# Altium schematic sheet Ethernet.SchDoc
size A; SheetNumber: 1; SheetTotal: 1
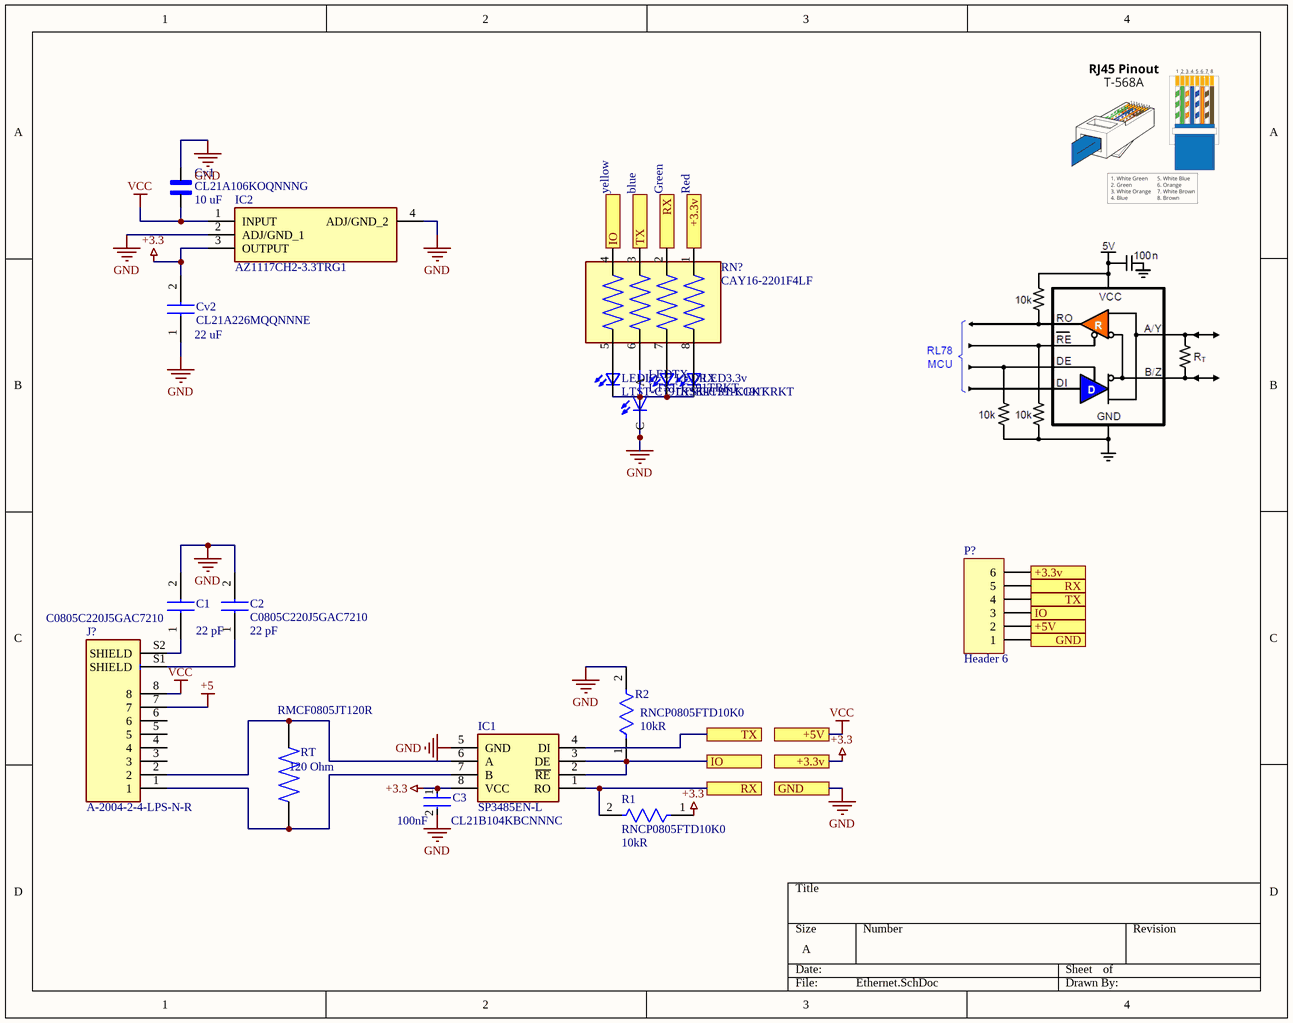
[diagram p0: Ethernet.SchDoc]

## Parts
C1  C0805C220J5GAC7210  Capacitance: 22 pF  [C0805]
C2  C0805C220J5GAC7210  Capacitance: 22 pF  [C0805]
C3  CL21B104KBCNNNC  Capacitance: 100nF  [FP-CL21-IPC_C]
Cv1  CL21A106KOQNNNG  value 10 uF  [CAPC2012X140N]
Cv2  CL21A226MQQNNNE  value 22 uF  [CAPC2012X140N]
IC1  SP3485EN-L  [SOIC127P600X175-8N]
IC2  AZ1117CH2-3.3TRG1  [SOT230P700X180-4N]
J?  A-2004-2-4-LPS-N-R  [ASSMANN_A-2004-2-4-LPS-N-R]
LED3.3v  LTST-C191KRKT  [0603]
LEDIO  LTST-C191KSKT  [0603]
LEDRX  LTST-C191KGKT  [0603]
LEDTX  LTST-C191TBKT  [LEDC1608X65N]
P?  Header 6  [HDR1X6]
R1  RNCP0805FTD10K0  Resistance: 10kR  [FP-RNCP0805-IPC_C]
R2  RNCP0805FTD10K0  Resistance: 10kR  [FP-RNCP0805-IPC_C]
RN?  CAY16-2201F4LF  [RESCAF80P320X160X60-8N]
RT  value 120 Ohm  [RESC2012X65N]  (hidden comment: RMCF0805JT120R)

## Ports
+3.3v, +5V, GND, IO, RX, TX

## Nets
+3.3: C3.1 Cv2.2 IC1.8(VCC) IC2.3(OUTPUT) P?.6 R1.1 RN?.1 ; port +3.3v
+5: J?.7
GND: C1.2 C2.2 C3.2 Cv1.2 Cv2.1 IC1.5(GND) IC2.2(ADJ/GND_1) IC2.4(ADJ/GND_2) LED3.3v.1(K2) LEDIO.1(K2) LEDRX.1(K2) LEDTX.C P?.1 R2.2 ; port GND
VCC: Cv1.1 IC2.1(INPUT) J?.8 P?.2 ; port +5V
IO: IC1.2(~{RE}) IC1.3(DE) P?.3 R2.1 RN?.4 ; port IO
RX: IC1.1(RO) P?.5 R1.2 RN?.2 ; port RX
TX: IC1.4(DI) P?.4 RN?.3 ; port TX
NetC1_1: C1.1 J?.S2(SHIELD)
NetC2_1: C2.1 J?.S1(SHIELD)
NetIC1_6: IC1.6(A) J?.2 RT.1
NetIC1_7: IC1.7(B) J?.1 RT.2
NetLED3.3v_2: LED3.3v.2(A2) RN?.8
NetLEDIO_2: LEDIO.2(A2) RN?.5
NetLEDRX_2: LEDRX.2(A2) RN?.7
NetLEDTX_A: LEDTX.A RN?.6

Not connected (* = marked no-connect by the designer): J? 3 4 5 6

## Notes on the sheet
- yellow
- blue
- Green
- Red

## Library data of the parts
C1 C2 = C0805C220J5GAC7210: Capacitor 22 pF; Manufacturer_Name: KEMET; Datasheet Link: https://content.kemet.com/datasheets/KEM_C1003_C0G_SMD.pdf; Height: 1.1mm; Manufacturer_Part_Number: C0805C220J5GAC7210; Mouser Part Number: 80-C0805C220J5GACLR; Mouser Price/Stock: https://www.mouser.co.uk/ProductDetail/KEMET/C0805C220J5GAC7210?qs=4DgSOGFclrNgR2ux5VsGDQ%3D%3D; Arrow Part Number: C0805C220J5GAC7210; Arrow Price/Stock: https://www.arrow.com/en/products/c0805c220j5gac7210/kemet-corporation
C3 = CMP-2000-05017-2: CL21 Series 0805 100nF 50V ±10% Tolerance X7R Multilayer Ceramic Chip Capacitor; Depth: 1.25mm; Height: 0.85mm; Width: 0.049inch; Tolerance: 10%; Case Code (Metric): 2012; Case Code (Imperial): 0805; Material: Ceramic; Thickness: 0.037inch; Min Operating Temperature: -55°C; Contact Plating: Tin; Length: 2mm; Mount: Surface Mount; Voltage Rating (DC): 50V; Lead Free: Lead Free; Dielectric: X7R; Radiation Hardening: No; Voltage Rating: 50V; Case/Package: 0805; Packaging: Tape and Reel; Max Operating Temperature: 125°C; Voltage: 50V
Cv1 = CL21A106KOQNNNG: MF: {'manufacturer': u'Samsung Electro-Mechanics'}; Package: None; Price: None; MP: CL21A106KOQNNNG; Availability: Unavailable
Cv2 = CL21A226MQQNNNE: Capacitor; Manufacturer_Name: SAMSUNG; Datasheet Link: http://product.samsungsem.com/mlcc/basic-search.do?partNumber=CL21A226MQQNNN; Height: 1.4mm; Manufacturer_Part_Number: CL21A226MQQNNNE; Mouser Part Number: 187-CL21A226MQQNNNE; Mouser Price/Stock: https://www.mouser.co.uk/ProductDetail/Samsung-Electro-Mechanics/CL21A226MQQNNNE?qs=349EhDEZ59oZnQF%252BO1HZ%252BQ%3D%3D; Arrow Part Number: CL21A226MQQNNNE; Arrow Price/Stock: https://www.arrow.com/en/products/cl21a226mqqnnne/samsung-electro-mechanics?region=nac
IC1 = SP3485EN-L: Integrated Circuit; Manufacturer_Name: EXAR; Datasheet Link: https://datasheet.datasheetarchive.com/originals/distributors/Datasheets-DGA14/1190127.pdf; Height: 1.75mm; Manufacturer_Part_Number: SP3485EN-L; Mouser Part Number: 701-SP3485EN-L; Mouser Price/Stock: https://www.mouser.com/Search/Refine.aspx?Keyword=701-SP3485EN-L; Arrow Part Number: SP3485EN-L; Arrow Price/Stock: https://www.arrow.com/en/products/sp3485en-l/exar
IC2 = AZ1117CH2-3.3TRG1: Integrated Circuit; Manufacturer_Name: Diodes Inc.; Datasheet Link: https://www.arrow.com/en/products/az1117ch2-3.3trg1/diodes-incorporated; Height: 1.8mm; Manufacturer_Part_Number: AZ1117CH2-3.3TRG1; Mouser Part Number: 621-AZ1117CH2-33TRG1; Mouser Price/Stock: https://www.mouser.co.uk/ProductDetail/Diodes-Incorporated/AZ1117CH2-3.3TRG1?qs=lQAVKuKFhkLc7jCxso2G3w%3D%3D; Arrow Part Number: AZ1117CH2-3.3TRG1; Arrow Price/Stock: https://www.arrow.com/en/products/az1117ch2-3.3trg1/diodes-incorporated?region=nac
J? = A-2004-2-4-LPS-N-R: Jack Modular Connector 8p8c (RJ45, Ethernet) 90Â° Angle (Right) Shielded; MF: {'manufacturer': u'Assmann WSW'}; Package: None; Price: None; Value: *; MP: A-2004-2-4-LPS-N-R; Availability: Unavailable
LED3.3v = LTST-C191KRKT: http://octopart.com/ltst-c190krkt-lite-on-549893; MF: {'manufacturer': u'Lite-On Electronics'}; Value: Red; Package: None; Price: None; MP: LTST-C191KRKT; Availability: Unavailable
LEDIO = LTST-C191KSKT: http://octopart.com/ltst-c190krkt-lite-on-549893; MF: {'manufacturer': u'Lite-On Inc.'}; Value: Yellow; Package: None; Price: None; MP: LTST-C191KSKT; Availability: Unavailable
LEDRX = LTST-C191KGKT: http://octopart.com/ltst-c190krkt-lite-on-549893; MF: {'manufacturer': u'Lite-On Inc.'}; Value: Green; Package: None; Price: None; MP: LTST-C191KGKT; Availability: Unavailable
LEDTX = LTST-C191TBKT: LED SMD 0603 Blue 30mcd 130deg; MF: {'manufacturer': u'Lite-On Electronics'}; Package: None; Price: None; Value: Blue; MP: LTST-C191TBKT; Availability: Unavailable
P? = Header 6: Header, 6-Pin; LatestRevisionDate: 17-Jul-2002; LatestRevisionNote: Re-released for DXP Platform.; Publisher: Altium Limited
R1 R2 = CMP-26527-007436-1: 10kΩ ±1% 0.25W 0805 High Power Anti-Sulfur Thin Film Chip Resistor; Max Power Dissipation: 250mW; Temperature Coefficient: 100ppm/°C; Number of Terminations: 2; Length: 0.079inch; Case Code (Metric): 2012; Mount: Surface Mount; Resistor Type: Thin Film; Packaging: Tape and Reel; Tolerance: 1%; RoHS Compliant: Yes; Case Code (Imperial): 0805; Min Operating Temperature: -55°C; Max Operating Temperature: 155°C; Features: Moisture Resistant; Series: RNCP; Case/Package: 0805; Width: 0.049inch; Lead Free: Lead Free; Height: 0.024inch
RN? = CAY16-2201F4LF: Res Thick Film Array 75 Ohm 5% 0.25W(1/4W) ?200ppm/C ISOL Molded 8-Pin 1206(4 X 0603) Convex SMD T/R; MF: {'manufacturer': u'Bourns'}; Package: None; Price: None; Value: *; MP: CAY16-2201F4LF; Availability: Unavailable
RT = RMCF0805JT120R: 120 Ohm; MF: {'manufacturer': u'Stackpole Electronics Inc'}; Package: None; Price: None; MP: RMCF0805JT120R; Availability: Unavailable; Supplier 1: Arrow Electronics; Supplier Part Number 1: RMCF0805JT120R